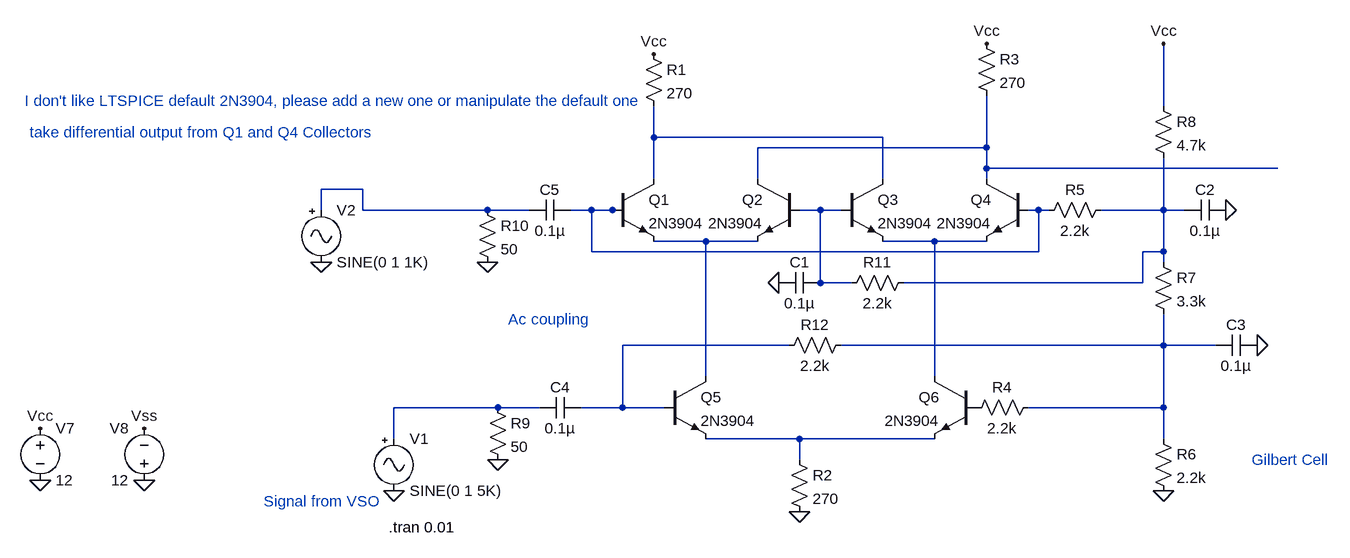
[diagram p0: schematic Gilbert Cell.asc]
Gilbert Cell.asc, the LTspice schematic file:
Version 4
SHEET 1 3396 680
WIRE 992 -16 992 -112
WIRE 208 32 208 -16
WIRE 560 32 208 32
WIRE 720 48 720 -32
WIRE 720 48 368 48
WIRE 720 80 720 48
WIRE 1168 80 720 80
WIRE 208 96 208 32
WIRE 368 96 368 48
WIRE 560 96 560 32
WIRE 720 96 720 80
WIRE -240 112 -304 112
WIRE -304 144 -304 112
WIRE -240 144 -240 112
WIRE -48 144 -240 144
WIRE 16 144 -48 144
WIRE 112 144 80 144
WIRE 144 144 112 144
WIRE 160 144 144 144
WIRE 464 144 432 144
WIRE 496 144 464 144
WIRE 800 144 784 144
WIRE 816 144 800 144
WIRE 992 144 992 64
WIRE 992 144 896 144
WIRE 1024 144 992 144
WIRE 288 192 208 192
WIRE 368 192 288 192
WIRE 640 192 560 192
WIRE 720 192 640 192
WIRE 112 208 112 144
WIRE 800 208 800 144
WIRE 800 208 112 208
WIRE 992 208 992 144
WIRE 992 208 960 208
WIRE 992 224 992 208
WIRE 464 256 464 144
WIRE 512 256 464 256
WIRE 960 256 960 208
WIRE 960 256 592 256
WIRE 416 352 160 352
WIRE 992 352 992 304
WIRE 992 352 496 352
WIRE 1072 352 992 352
WIRE 288 400 288 192
WIRE 640 400 640 192
WIRE -32 448 -192 448
WIRE 32 448 -32 448
WIRE 160 448 160 352
WIRE 160 448 96 448
WIRE 224 448 160 448
WIRE 992 448 992 352
WIRE 992 448 784 448
WIRE -192 496 -192 448
WIRE 432 496 288 496
WIRE 640 496 432 496
WIRE 992 496 992 448
WIRE 432 528 432 496
FLAG 208 -96 Vcc
FLAG 720 -112 Vcc
FLAG 400 256 0
FLAG 432 608 0
FLAG 992 576 0
FLAG 1088 144 0
FLAG 992 -112 Vcc
FLAG 1136 352 0
FLAG -32 528 0
FLAG -192 576 0
FLAG -48 224 0
FLAG -736 560 0
FLAG -576 560 0
FLAG -736 480 Vcc
FLAG -576 480 Vss
FLAG -304 224 0
SYMBOL res 192 -112 R0
SYMATTR InstName R1
SYMATTR Value 270
SYMBOL res 704 -128 R0
SYMATTR InstName R3
SYMATTR Value 270
SYMBOL cap 464 240 R90
WINDOW 0 0 32 VBottom 2
WINDOW 3 32 32 VTop 2
SYMATTR InstName C1
SYMATTR Value 0.1µ
SYMBOL res 416 512 R0
SYMATTR InstName R2
SYMATTR Value 270
SYMBOL res 800 432 R90
WINDOW 0 0 56 VBottom 2
WINDOW 3 32 56 VTop 2
SYMATTR InstName R4
SYMATTR Value 2.2k
SYMBOL res 912 128 R90
WINDOW 0 0 56 VBottom 2
WINDOW 3 32 56 VTop 2
SYMATTR InstName R5
SYMATTR Value 2.2k
SYMBOL res 976 480 R0
SYMATTR InstName R6
SYMATTR Value 2.2k
SYMBOL res 976 208 R0
SYMATTR InstName R7
SYMATTR Value 3.3k
SYMBOL cap 1088 128 R90
WINDOW 0 0 32 VBottom 2
WINDOW 3 32 32 VTop 2
SYMATTR InstName C2
SYMATTR Value 0.1µ
SYMBOL res 976 -32 R0
SYMATTR InstName R8
SYMATTR Value 4.7k
SYMBOL cap 1136 336 R90
WINDOW 0 0 32 VBottom 2
WINDOW 3 32 32 VTop 2
SYMATTR InstName C3
SYMATTR Value 0.1µ
SYMBOL cap 96 432 R90
WINDOW 0 0 32 VBottom 2
WINDOW 3 32 32 VTop 2
SYMATTR InstName C4
SYMATTR Value 0.1µ
SYMBOL res -48 432 R0
SYMATTR InstName R9
SYMATTR Value 50
SYMBOL Misc\\signal -192 480 R0
WINDOW 123 0 0 Left 2
WINDOW 39 0 0 Left 2
SYMATTR InstName V1
SYMATTR Value SINE(0 1 5K)
SYMBOL cap 80 128 R90
WINDOW 0 0 32 VBottom 2
WINDOW 3 32 32 VTop 2
SYMATTR InstName C5
SYMATTR Value 0.1µ
SYMBOL res -64 128 R0
SYMATTR InstName R10
SYMATTR Value 50
SYMBOL res 608 240 R90
WINDOW 0 0 56 VBottom 2
WINDOW 3 32 56 VTop 2
SYMATTR InstName R11
SYMATTR Value 2.2k
SYMBOL res 512 336 R90
WINDOW 0 0 56 VBottom 2
WINDOW 3 32 56 VTop 2
SYMATTR InstName R12
SYMATTR Value 2.2k
SYMBOL npn 144 96 R0
SYMATTR InstName Q1
SYMATTR Value 2N3904
SYMBOL npn 432 96 M0
SYMATTR InstName Q2
SYMATTR Value 2N3904
SYMBOL npn 784 96 M0
SYMATTR InstName Q4
SYMATTR Value 2N3904
SYMBOL npn 496 96 R0
SYMATTR InstName Q3
SYMATTR Value 2N3904
SYMBOL npn 224 400 R0
SYMATTR InstName Q5
SYMATTR Value 2N3904
SYMBOL npn 704 400 M0
SYMATTR InstName Q6
SYMATTR Value 2N3904
SYMBOL voltage -736 464 R0
WINDOW 123 0 0 Left 2
WINDOW 39 0 0 Left 2
SYMATTR InstName V7
SYMATTR Value 12
SYMBOL voltage -576 576 R180
WINDOW 0 24 96 Left 2
WINDOW 3 24 16 Left 2
WINDOW 123 0 0 Left 2
WINDOW 39 0 0 Left 2
SYMATTR InstName V8
SYMATTR Value 12
SYMBOL Misc\\signal -304 128 R0
SYMATTR InstName V2
TEXT -200 632 Left 2 !.tran 0.01
TEXT 1128 528 Left 2 ;Gilbert Cell
TEXT -16 312 Left 2 ;Ac coupling
TEXT -392 592 Left 2 ;Signal from VSO
TEXT -760 -24 Left 2 ;I don't like LTSPICE default 2N3904, please add a new one or manipulate the default one
TEXT -752 24 Left 2 ;take differential output from Q1 and Q4 Collectors

The netlist it stands for:
* Gilbert Cell.asc
R1 Vcc N001 270
R3 Vcc N002 270
C1 N005 0 0.1µ
R2 N012 0 270
R4 N010 P001 2.2k
R5 N006 N004 2.2k
R6 N010 0 2.2k
R7 N006 N010 3.3k
C2 0 N006 0.1µ
R8 Vcc N006 4.7k
C3 0 N010 0.1µ
C4 N009 N011 0.1µ
R9 N011 0 50
V1 N011 0 SINE(0 1 5K)
C5 N004 N003 0.1µ
R10 N003 0 50
R11 N006 N005 2.2k
R12 N010 N009 2.2k
Q1 N001 N004 N007 0 2N3904
Q2 N002 N005 N007 0 2N3904
Q4 N002 N004 N008 0 2N3904
Q3 N001 N005 N008 0 2N3904
Q5 N007 N009 N012 0 2N3904
Q6 N008 P001 N012 0 2N3904
V7 Vcc 0 12
V8 0 Vss 12
V2 N003 0 SINE(0 1 1K)
.model NPN NPN
.model PNP PNP
.lib standard.bjt
.tran 0.01
* Gilbert Cell
* Ac coupling
* Signal from VSO
* I don't like LTSPICE default 2N3904, please add a new one or manipulate the default one
* take differential output from Q1 and Q4 Collectors
.backanno
.end